# EAGLE design wt12_uart_breakout_board_v20 (EAGLE 6.4)
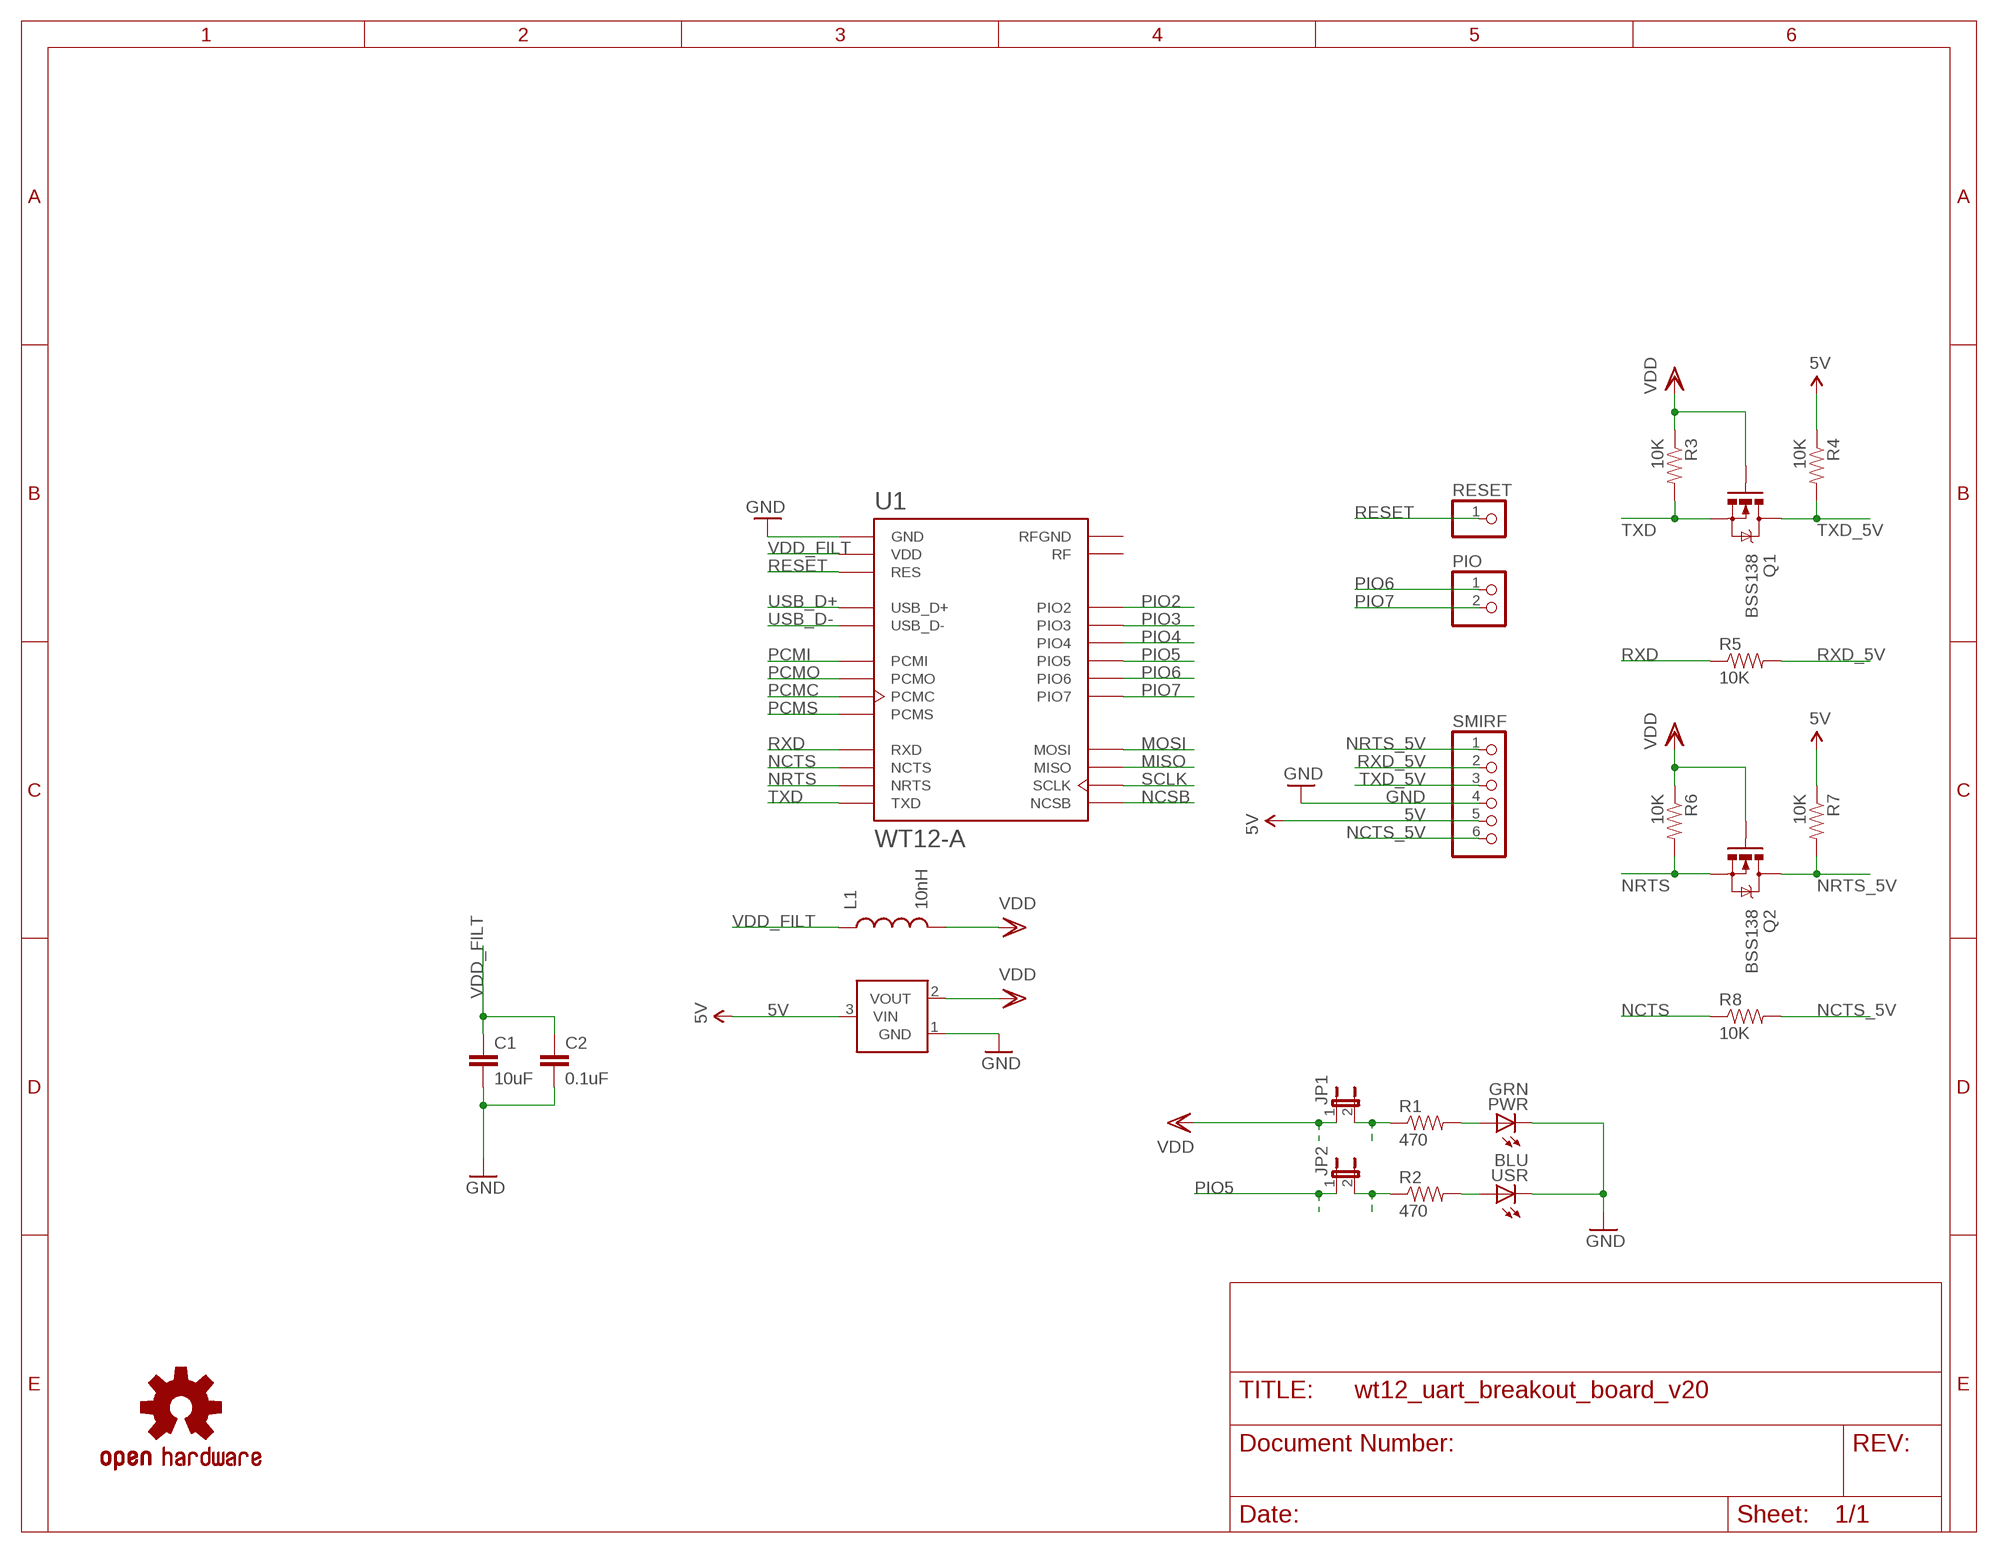
[diagram p0: schematic, sheet 1]

## Parts
C1  10uF  CAP0603-CAP  [0603-CAP]
C2  0.1uF  CAP0603-CAP  [0603-CAP]
JP1  JUMPER-2SMD-NC  [SJ_2S]
JP2  JUMPER-2SMD-NC  [SJ_2S]
L1  10nH  INDUCTOR0603  [0603]
PIO  PINHD-1X2  [1X02]
PWR  GRN  LEDCHIPLED_0805  [CHIPLED_0805]
Q1  BSS138  MOSFET-NCHANNELSMD  [SOT23-3]
Q2  BSS138  MOSFET-NCHANNELSMD  [SOT23-3]
R1  470  RESISTOR0603-RES  [0603-RES]
R2  470  RESISTOR0603-RES  [0603-RES]
R3  10K  RESISTOR0603-RES  [0603-RES]
R4  10K  RESISTOR0603-RES  [0603-RES]
R5  10K  RESISTOR0603-RES  [0603-RES]
R6  10K  RESISTOR0603-RES  [0603-RES]
R7  10K  RESISTOR0603-RES  [0603-RES]
R8  10K  RESISTOR0603-RES  [0603-RES]
RESET  PINHD-1X1  [1X01]
SMIRF  PINHD-1X6  [1X06]
U1  WT12-A  [WT12-A]
U2  MCP1700  [SOT23-3]
U$5  OSHW-LOGOM  [OSHW-LOGO-M]
USR  BLU  LEDCHIPLED_0805  [CHIPLED_0805]

## Nets
5V [power]: R4.1 R7.1 SMIRF.5 U2.3(VIN)
GND [power]: C1.2 C2.2 PWR.C SMIRF.4 U1.GND U1.GND@2(GND) U1.GND@3(GND) U1.GND@4(GND) U2.1(GND) USR.C
MISO: U1.MISO
MOSI: U1.MOSI
N$1: PWR.A R1.2
N$3: R2.2 USR.A
N$4: JP2.2 R2.1
NCSB: U1.NCSB
NCTS: R8.1 U1.NCTS
NCTS_5V: R8.2 SMIRF.6
NRTS: Q2.2(S) R6.2 U1.NRTS
NRTS_5V: Q2.3(D) R7.2 SMIRF.1
PCMC: U1.PCMC
PCMI: U1.PCMI
PCMO: U1.PCMO
PCMS: U1.PCMS
PIO2: U1.PIO2
PIO3: U1.PIO3
PIO4: U1.PIO4
PIO5: JP2.1 U1.PIO5
PIO6: PIO.1 U1.PIO6
PIO7: PIO.2 U1.PIO7
RESET: RESET.1 U1.RES
RXD: R5.1 U1.RXD
RXD_5V: R5.2 SMIRF.2
SCLK: U1.SCLK
TXD: Q1.2(S) R3.2 U1.TXD
TXD_5V: Q1.3(D) R4.2 SMIRF.3
USB_D+: U1.USB_D+
USB_D-: U1.USB_D-
VDD [power]: JP1.1 L1.2 Q1.1(G) Q2.1(G) R3.1 R6.1 U2.2(VOUT)
VDD_FILT [power]: C1.1 C2.1 L1.1 U1.VDD U1.VDD@2(VDD)
VDDJP1 [power]: JP1.2 R1.1
Unconnected: U1.RF U1.RFGND U1.RFGND@2(RFGND)

## Library data of the parts
C1 C2 = SparkFun:CAP: Capacitor Standard 0603 ceramic capacitor, and 0.1" leaded capacitor.
JP1 JP2 = SparkFun:JUMPER-2: Jumper Basic 0.1" spaced jumper. Use with breakaway headers.
L1 = SparkFun:INDUCTOR: Inductors Basic Inductor/Choke - 0603 and 1206. Footprints are not proven and vary greatly between part numbers.
PIO = sf-pinhead:PINHD-1X2: PIN HEADER
PWR USR = adafruit:LED: LED OSRAM: - CHIPLED LG R971, LG N971, LY N971, LG Q971, LY Q971, LO R971, LY R971 LH N974, LH R974 LS Q976, LO Q976, LY Q976 LO Q996 - Hyper CHIPLED LW Q18S LB Q993, LB Q99A, LB R99A - SideLED LS A670, LO A670, LY A670, LG A670, LP A670 LB A673, LV A673, LT A673, LW A673 LH A674 LY A675 LS A676, LA A676, LO A676, LY A676, LW A676 LS A679, LY A679, LG A679 - Hyper Micro SIDELED® LS Y876, LA Y876, LO Y876, LY Y876 LT Y87S - SmartLED LW L88C, LW L88S LB L89C, LB L89S, LG L890 LS L89K, LO L89K, LY L89K LS L896, LA L896, LO L896, LY L896 - TOPLED LS T670, LO T670, LY T670, LG T670, LP T670 LSG T670, LSP T670, LSY T670, LOP T670, LYG T670 LG T671, LOG T671, LSG T671 LB T673, LV T673, LT T673, LW T673 LH T674 LS T676, LA T676, LO T676, LY T676, LB T676, LH T676, LSB T676, LW T676 LB T67C, LV T67C, LT T67C, LS T67K, LO T67K, LY T67K, LW E67C LS E67B, LA E67B, LO E67B, LY E67B, LB E67C, LV E67C, LT E67C LW T67C LS T679, LY T679, LG T679 LS T770, LO T770, LY T770, LG T770, LP T770 LB T773, LV T773, LT T773, LW T773 LH T774 LS E675, LA E675, LY E675, LS T675 LS T776, LA T776, LO T776, LY T776, LB T776 LHGB T686 LT T68C, LB T68C - Hyper Mini TOPLED® LB M676 - Mini TOPLED Santana® LG M470 LS M47K, LO M47K, LY M47K Source: http://www.osram.convergy.de/
Q1 Q2 = SparkFun:MOSFET-NCHANNEL
R1-R8 = SparkFun:RESISTOR: Resistor Basic schematic elements and footprints for 0603, 1206, and PTH resistors.
RESET = sf-pinhead:PINHD-1X1: PIN HEADER
SMIRF = sf-pinhead:PINHD-1X6: PIN HEADER
U1 = sf-bluegiga:WT12-A: Class 2 Bluetooth 2.1 + EDR module, chip antenna and RF pins
U2 = nonolith:MCP1700: Voltage regulator
U$5 = SparkFun:OSHW-LOGO: Open Source Hardware Logo This logo indicates the piece of hardware it is found on incorporates a OSHW license and/or adheres to the definition of open source hardware found here: http://freedomdefined.org/OSHW

## Net classes
0 default: width 0.152 mm, drill 0.33 mm, clearance 0.152 mm
1 power: width 0.254 mm, drill 0.33 mm, clearance 0.152 mm

## Board
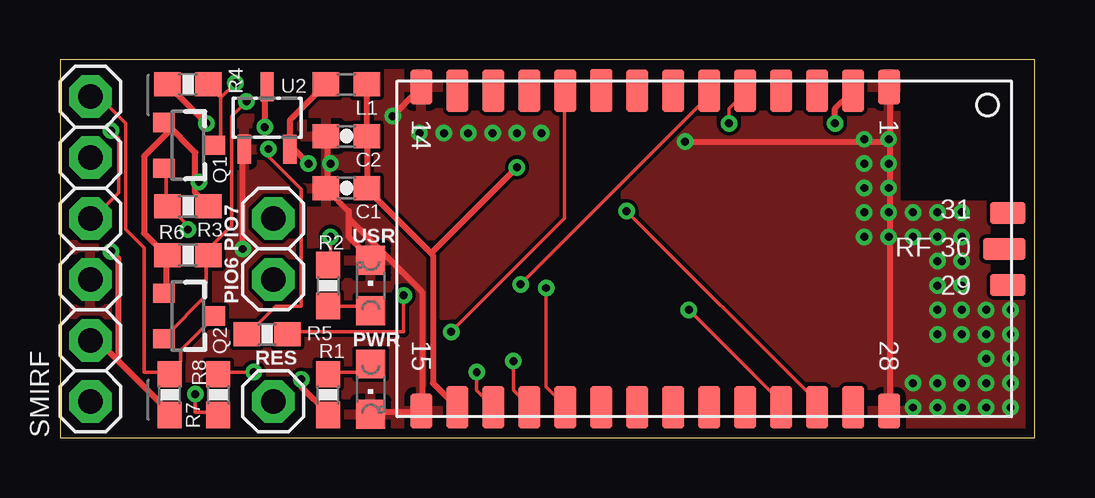
[diagram p1: board, top side]
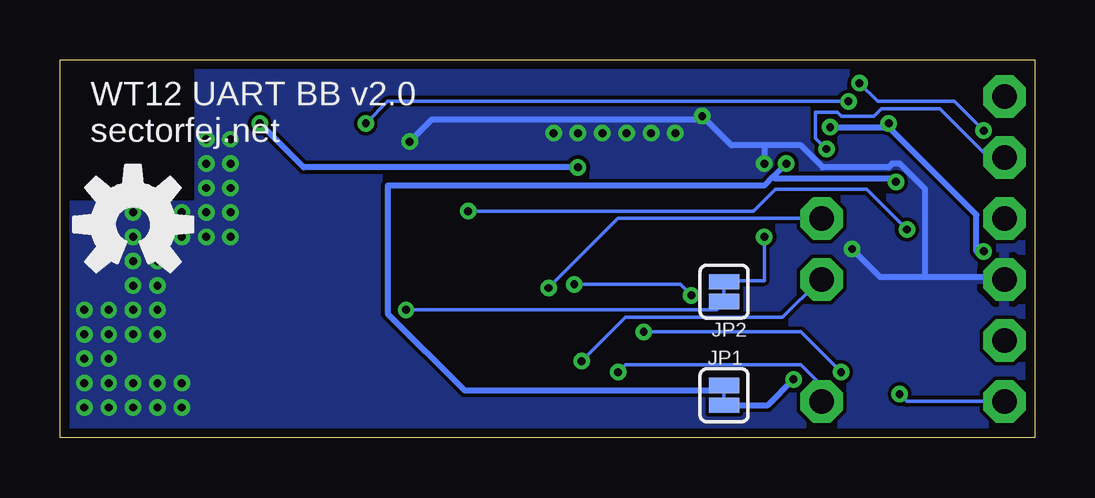
[diagram p2: board, bottom side, seen from below]

Size 40.64 x 15.75 mm. Coordinates in mm from the lower left corner, seen from the top.
Outline: 0,0 40.64,0 40.64,15.75 0,15.75 0,0
Copper layers (1*16): Top 0.0356mm / dielectric 1.5011mm / Bottom 0.0356mm
Design rules "LaenPCBOrder *": minimum track width 6mil, minimum drill 13mil, track to track 6mil, track to pad 6mil, pad to pad 6mil, via to via 6mil, smd to smd 6mil, copper to edge 15mil, drill to drill 6mil, minimum pad ring 7mil, minimum via ring 7mil, stop-mask expansion 4mil, vias tented up to drill 13mil, thermal gap 10mil
tRestrict: area 35.1,9.9 to 40.6,15.7
bRestrict: area 35.1,9.9 to 40.6,15.7
vRestrict: area 2.5,0 to 3.8,15.2; area 12.2,8.1 to 13.7,8.6; area 12.2,3.8 to 13.7,4.3

### Footprints (pad centres in the part's own frame; a part is rotated, then mirrored left to right if it is on the bottom)
0603-CAP = smd 1.1 x 1: 1 -0.85,0; 2 0.85,0
SJ_2S = smd 0.635 x 1.27: 1 -0.412,0; 2 0.412,0
0603 = smd 1.1 x 1: 1 -0.85,0; 2 0.85,0
1X02 = drill 1.016 pad 1.778 octagon: 1 -1.27,0; 2 1.27,0
CHIPLED_0805 = smd 1.2 x 1.2: A 0,-1.05; C 0,1.05
SOT23-3 = smd 0.8 x 0.9: 1 -0.95,-1; 2 0.95,-1; 3 0,1.1
0603-RES = smd 1.1 x 1: 1 -0.85,0; 2 0.85,0
1X01 = drill 1.016 pad 1.778 octagon: 1 0,0
1X06 = drill 1.016 pad 1.778 octagon: 1 -6.35,0; 2 -3.81,0; 3 -1.27,0; 4 1.27,0; 5 3.81,0; 6 6.35,0
WT12-A = smd 1.478 x 0.914: GND -6.75,7.7; GND@2 -6.75,-11.8; GND@3 6.75,-11.8; GND@4 6.75,7.7 | smd 1.778 x 0.914: MISO 6.6,0.2; MOSI 6.6,1.7; NC 6.6,6.2; NCSB 6.6,-2.8; NCTS -6.6,-5.8; NRTS -6.6,1.7; PCMC -6.6,-8.8; PCMI -6.6,-7.3; PCMO -6.6,-1.3; PCMS -6.6,-10.3; PIO2 -6.6,4.7; PIO3 -6.6,3.2; PIO4 6.6,-4.3; PIO5 6.6,3.2; PIO6 6.6,-7.3; PIO7 6.6,-5.8; RES 6.6,-8.8; RXD -6.6,0.2; SCLK 6.6,-1.3; TXD 6.6,4.7; USB_D+ -6.6,-2.8; USB_D- -6.6,-4.3; VDD -6.6,6.2; VDD@2 6.6,-10.3 | smd 0.914 x 1.778: RF 0,12.5 | smd 0.914 x 1.478: RFGND 1.5,12.65; RFGND@2 -1.5,12.65
SOT23-3' = smd 0.55 x 1.2: 1 0.95,1.3; 2 -0.95,1.3; 3 0,-1.3

### Placement (x,y rotation side)
C1  11.94,10.41 180 top
C2  11.94,12.57 180 top
JP1  12.95,1.78 270 bottom
JP2  12.95,6.1 90 bottom
L1  11.94,14.73 180 top
PIO  8.89,7.87 90 top
PWR  12.95,2.03 180 top
Q1  5.33,12.19 270 top
Q2  5.33,5.08 270 top
R1  11.18,1.8 90 top
R2  11.18,6.35 270 top
R3  5.33,9.65 180 top
R4  5.33,14.73 0 top
R5  8.64,4.32 180 top
R6  5.33,7.62 0 top
R7  4.57,1.8 90 top
R8  6.6,1.8 270 top
RESET  8.89,1.52 0 top
SMIRF  1.27,7.87 270 top
U1  26.86,7.87 270 top
U2  MCP1700  [SOT23-3']  8.64,13.34 180 top
U$5  37.59,8.89 0 bottom
USR  12.95,6.35 0 top

### Tracks (layer width: path | path; a pad name or v marks a point on that pad's centre or on a via)
5V  (via drill 0.33)
  Top 0.254: v6.1,13.11 4.57,14.63 R4.1 | v8.53,12.95 8.53,14.63 U2.3 | 2.36,3.28 1.68,3.96 1.37,3.96 SMIRF.5 | 2.36,3.28 4.57,1.07 R7.1 | v2.13,7.77 2.44,7.47 2.44,3.35 2.36,3.28
  Bottom 0.254: v8.53,12.95 6.25,12.95 v6.1,13.11 6.1,12.95 2.44,9.3 2.44,7.77 v2.13,7.77
GND  (via drill 0.33)
  Top 0.254: PWR.C 12.95,1.07 14.94,1.07 U1.GND@3 15.09,1.22 15.09,6.1 12.04,9.14 | 11.12,11.43 11.12,12.5 C2.2 | 11.12,11.43 11.12,10.52 C1.2 11.12,10.36 12.04,9.45 12.04,9.14 | 12.04,9.14 12.04,8.38 12.95,7.47 USR.C | 34.59,12.34 34.59,14.48 U1.GND 34.59,14.63 | 34.59,12.34 34.59,1.22 U1.GND@4 | 15.09,14.63 U1.GND@2 14.94,14.48 v13.87,13.41 | 7.77,12.04 U2.1 7.62,11.89 v7.62,7.87 | v26.06,12.34 34.59,12.34 | v11.28,11.43 11.12,11.43
  Bottom 0.254: v7.62,7.87 6.45,6.71 4.57,6.71 | 4.57,6.71 1.37,6.71 SMIRF.4 | 11.28,12.19 9.75,12.19 8.84,11.28 6.1,11.28 5.94,11.43 5.64,11.43 4.57,10.36 4.57,6.71 | 11.28,12.19 12.65,12.19 v13.87,13.41 13.87,13.26 25.15,13.26 v26.06,12.34 | 11.28,12.19 v11.28,11.43
  other vias: 34.54,9.4 34.54,10.41 34.54,11.43 34.54,12.45 33.53,12.45 33.53,11.43 33.53,10.41 33.53,9.4 33.53,8.38 34.54,8.38 35.56,9.4 36.58,9.4 37.59,9.4 35.56,8.38 36.58,8.38 37.59,8.38 37.59,7.37 37.59,6.35 37.59,5.33 38.61,5.33 39.62,5.33 39.62,4.32 39.62,3.3 39.62,2.29 39.62,1.27 38.61,1.27 37.59,1.27 36.58,1.27 35.56,1.27 38.61,4.32 38.61,3.3 38.61,2.29 37.59,2.29 36.58,2.29 35.56,2.29 36.58,7.37 36.58,6.35 36.58,5.33 37.59,4.32 36.58,4.32 20.07,12.7 19.05,12.7 18.03,12.7 17.02,12.7 16,12.7 14.99,12.7
  pour Top: 0,15.75 40.64,15.75 40.64,0 0,0
  pour Bottom: 0,15.75 40.64,15.75 40.64,0 0,0
N$1
  Top 0.152: PWR.A 12.95,2.74 11.28,2.74 R1.2
N$3
  Top 0.152: USR.A 12.95,5.49 11.28,5.49 R2.2
N$4  (via drill 0.33)
  Top 0.152: v11.28,8.38 11.28,7.32 R2.1
  Bottom 0.152: v11.28,8.38 11.28,6.55 12.95,6.55 JP2.2
N$5
  Bottom 0.152: 12.95,1.52 12.95,2.03
N$6
  Bottom 0.152: 12.95,5.84 12.95,6.35
NCTS  (via drill 0.33)
  Top 0.152: v8.08,2.74 6.71,2.74 R8.1 | v16.31,4.42 21.03,9.14 21.03,14.33 U1.NCTS
  Bottom 0.152: v8.08,2.74 9.75,4.42 v16.31,4.42
NCTS_5V  (via drill 0.33)
  Top 0.152: v5.64,1.83 5.64,1.07 6.55,1.07 R8.2
  Bottom 0.152: v5.64,1.83 5.33,1.52 SMIRF.6
NRTS  (via drill 0.33)
  Top 0.152: Q2.2 4.42,4.27 6.1,5.94 6.1,7.62 R6.2 6.25,7.62 6.25,7.92 7.16,8.84 7.16,13.41 v7.77,14.02 | v27.89,13.11 27.89,13.72 28.5,14.33 U1.NRTS
  Bottom 0.152: v27.89,13.11 26.98,14.02 v7.77,14.02
NRTS_5V
  Top 0.152: 4.57,2.74 5.03,3.2 5.03,3.66 6.4,5.03 Q2.3 | 4.57,2.74 3.5,2.74 3.5,7.92 2.74,8.69 2.74,13.11 1.68,14.17 1.37,14.17 SMIRF.1 | 4.57,2.74 R7.2
PIO5  (via drill 0.33)
  Top 0.152: v26.21,5.33 30.02,1.52 30.02,1.37 U1.PIO5
  Bottom 0.152: v26.21,5.33 13.26,5.33 12.95,5.64 JP2.1
PIO6  (via drill 0.33)
  Top 0.152: v18.9,3.2 18.9,1.98 19.51,1.37 U1.PIO6
  Bottom 0.152: v18.9,3.2 17.07,5.03 10.52,5.03 8.99,6.55 PIO.1
PIO7  (via drill 0.33)
  Top 0.152: v20.27,6.25 20.27,2.13 21.03,1.37 U1.PIO7
  Bottom 0.152: v20.27,6.25 17.37,9.14 PIO.2
RESET  (via drill 0.33)
  Top 0.152: v17.37,2.74 17.37,1.98 17.98,1.37 U1.RES
  Bottom 0.152: v17.37,2.74 17.07,3.05 9.75,3.05 8.99,2.29 8.99,1.52 RESET.1
RXD  (via drill 0.33)
  Top 0.152: v14.33,5.94 14.33,4.42 9.6,4.42 R5.1 | v19.2,6.4 26.98,14.17 26.98,14.33 U1.RXD
  Bottom 0.152: v14.33,5.94 14.78,6.4 v19.2,6.4
RXD_5V  (via drill 0.33)
  Top 0.152: v8.69,12.04 8.69,11.73 10.06,10.36 10.06,5.49 8.99,5.49 7.92,4.42 R5.2
  Bottom 0.152: v8.69,12.04 9.14,12.5 9.14,13.56 8.23,13.56 8.08,13.41 6.71,13.41 6.4,13.72 3.96,13.72 1.98,11.73 1.37,11.73 SMIRF.2
TXD  (via drill 0.33)
  Top 0.152: Q1.2 4.42,11.12 4.42,9.75 R3.2 4.57,9.6 5.33,8.84 v5.33,8.69 | v23.62,9.45 31.55,1.52 31.55,1.37 U1.TXD
  Bottom 0.152: v5.33,8.69 7.01,10.36 10.82,10.36 11.73,9.45 v23.62,9.45
TXD_5V  (via drill 0.33)
  Top 0.152: 6.71,14.17 6.71,12.34 6.55,12.19 Q1.3 | 6.71,14.17 6.25,14.63 R4.2 | v7.32,14.78 6.71,14.17 | v2.13,12.8 2.44,12.5 2.44,10.21 1.37,9.14 SMIRF.3
  Bottom 0.152: v7.32,14.78 6.55,14.02 3.35,14.02 v2.13,12.8
VDD  (via drill 0.33)
  Top 0.254: 4.42,7.62 4.42,6.1 Q2.1 | 5.64,10.67 5.64,10.21 6.1,9.75 R3.1 | 5.64,10.67 5.64,11.89 4.42,13.11 Q1.1 4.57,12.8 3.5,11.73 3.5,8.53 4.42,7.62 | 4.42,7.62 R6.1 | 9.6,12.19 9.6,12.04 U2.2 9.6,12.19 | 9.6,12.19 9.6,13.26 10.97,14.63 L1.2 | 9.6,12.19 v10.36,11.43 | v5.79,10.67 5.64,10.67
  Bottom 0.254: v10.36,11.43 10.9,10.9 | 10.9,10.9 11.28,10.52 26.98,10.52 26.98,5.18 23.77,1.98 13.11,1.98 12.95,2.13 JP1.1 | v5.79,10.67 5.94,10.82 10.82,10.82 10.9,10.9
VDD_FILT  (via drill 0.33)
  Top 0.254: L1.1 12.8,14.63 12.8,12.65 C2.1 12.8,12.5 12.8,10.52 C1.1 12.8,10.36 15.47,7.7 | 15.47,7.7 15.54,7.62 15.54,2.29 16.46,1.37 U1.VDD@2 | v32.31,13.11 32.31,13.72 32.92,14.33 U1.VDD | 15.47,7.7 v19.05,11.28
  Bottom 0.254: v32.31,13.11 30.48,11.28 v19.05,11.28
VDDJP1  (via drill 0.33)
  Top 0.254: v10.06,2.44 10.06,2.13 11.12,1.07 R1.1
  Bottom 0.254: v10.06,2.44 11.12,1.37 JP1.2

### Text on the board
tPlace: PIO6 PIO7 | RES
bPlace: WT12 UART BB v2.0 | sectorfej.net
tDocu: RTS RXD TXD GND VCC CTS | Bluegiga / WT12-A
bDocu: PIO5 | PWR